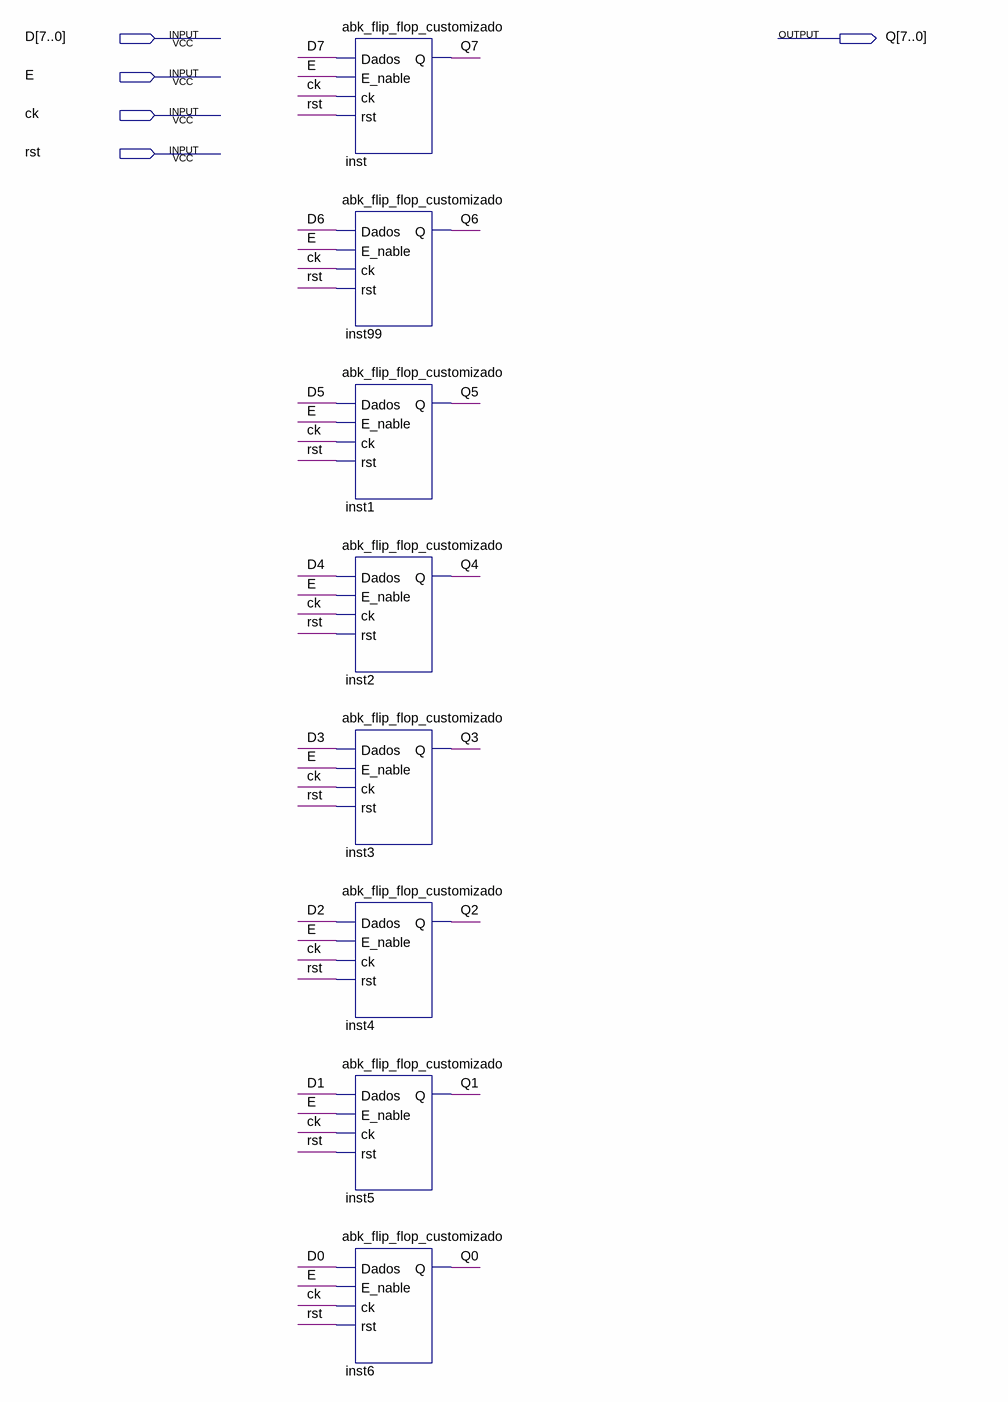
[diagram p0: schematic sheet]
// Quartus schematic abk_reg_generico.bdf as structural Verilog: 8 symbols, 5 pins
module abk_reg_generico (
  input  [7:0] D,
  input  E,
  input  ck,
  input  rst,
  output [7:0] Q
);

  abk_flip_flop_customizado inst (.Dados(D[7]), .E_nable(E), .ck(ck), .rst(rst), .Q(Q[7]));
  abk_flip_flop_customizado inst99 (.Dados(D[6]), .E_nable(E), .ck(ck), .rst(rst), .Q(Q[6]));
  abk_flip_flop_customizado inst1 (.Dados(D[5]), .E_nable(E), .ck(ck), .rst(rst), .Q(Q[5]));
  abk_flip_flop_customizado inst2 (.Dados(D[4]), .E_nable(E), .ck(ck), .rst(rst), .Q(Q[4]));
  abk_flip_flop_customizado inst3 (.Dados(D[3]), .E_nable(E), .ck(ck), .rst(rst), .Q(Q[3]));
  abk_flip_flop_customizado inst4 (.Dados(D[2]), .E_nable(E), .ck(ck), .rst(rst), .Q(Q[2]));
  abk_flip_flop_customizado inst5 (.Dados(D[1]), .E_nable(E), .ck(ck), .rst(rst), .Q(Q[1]));
  abk_flip_flop_customizado inst6 (.Dados(D[0]), .E_nable(E), .ck(ck), .rst(rst), .Q(Q[0]));
endmodule
